# Altium project USBAutoMouse.PrjPcb
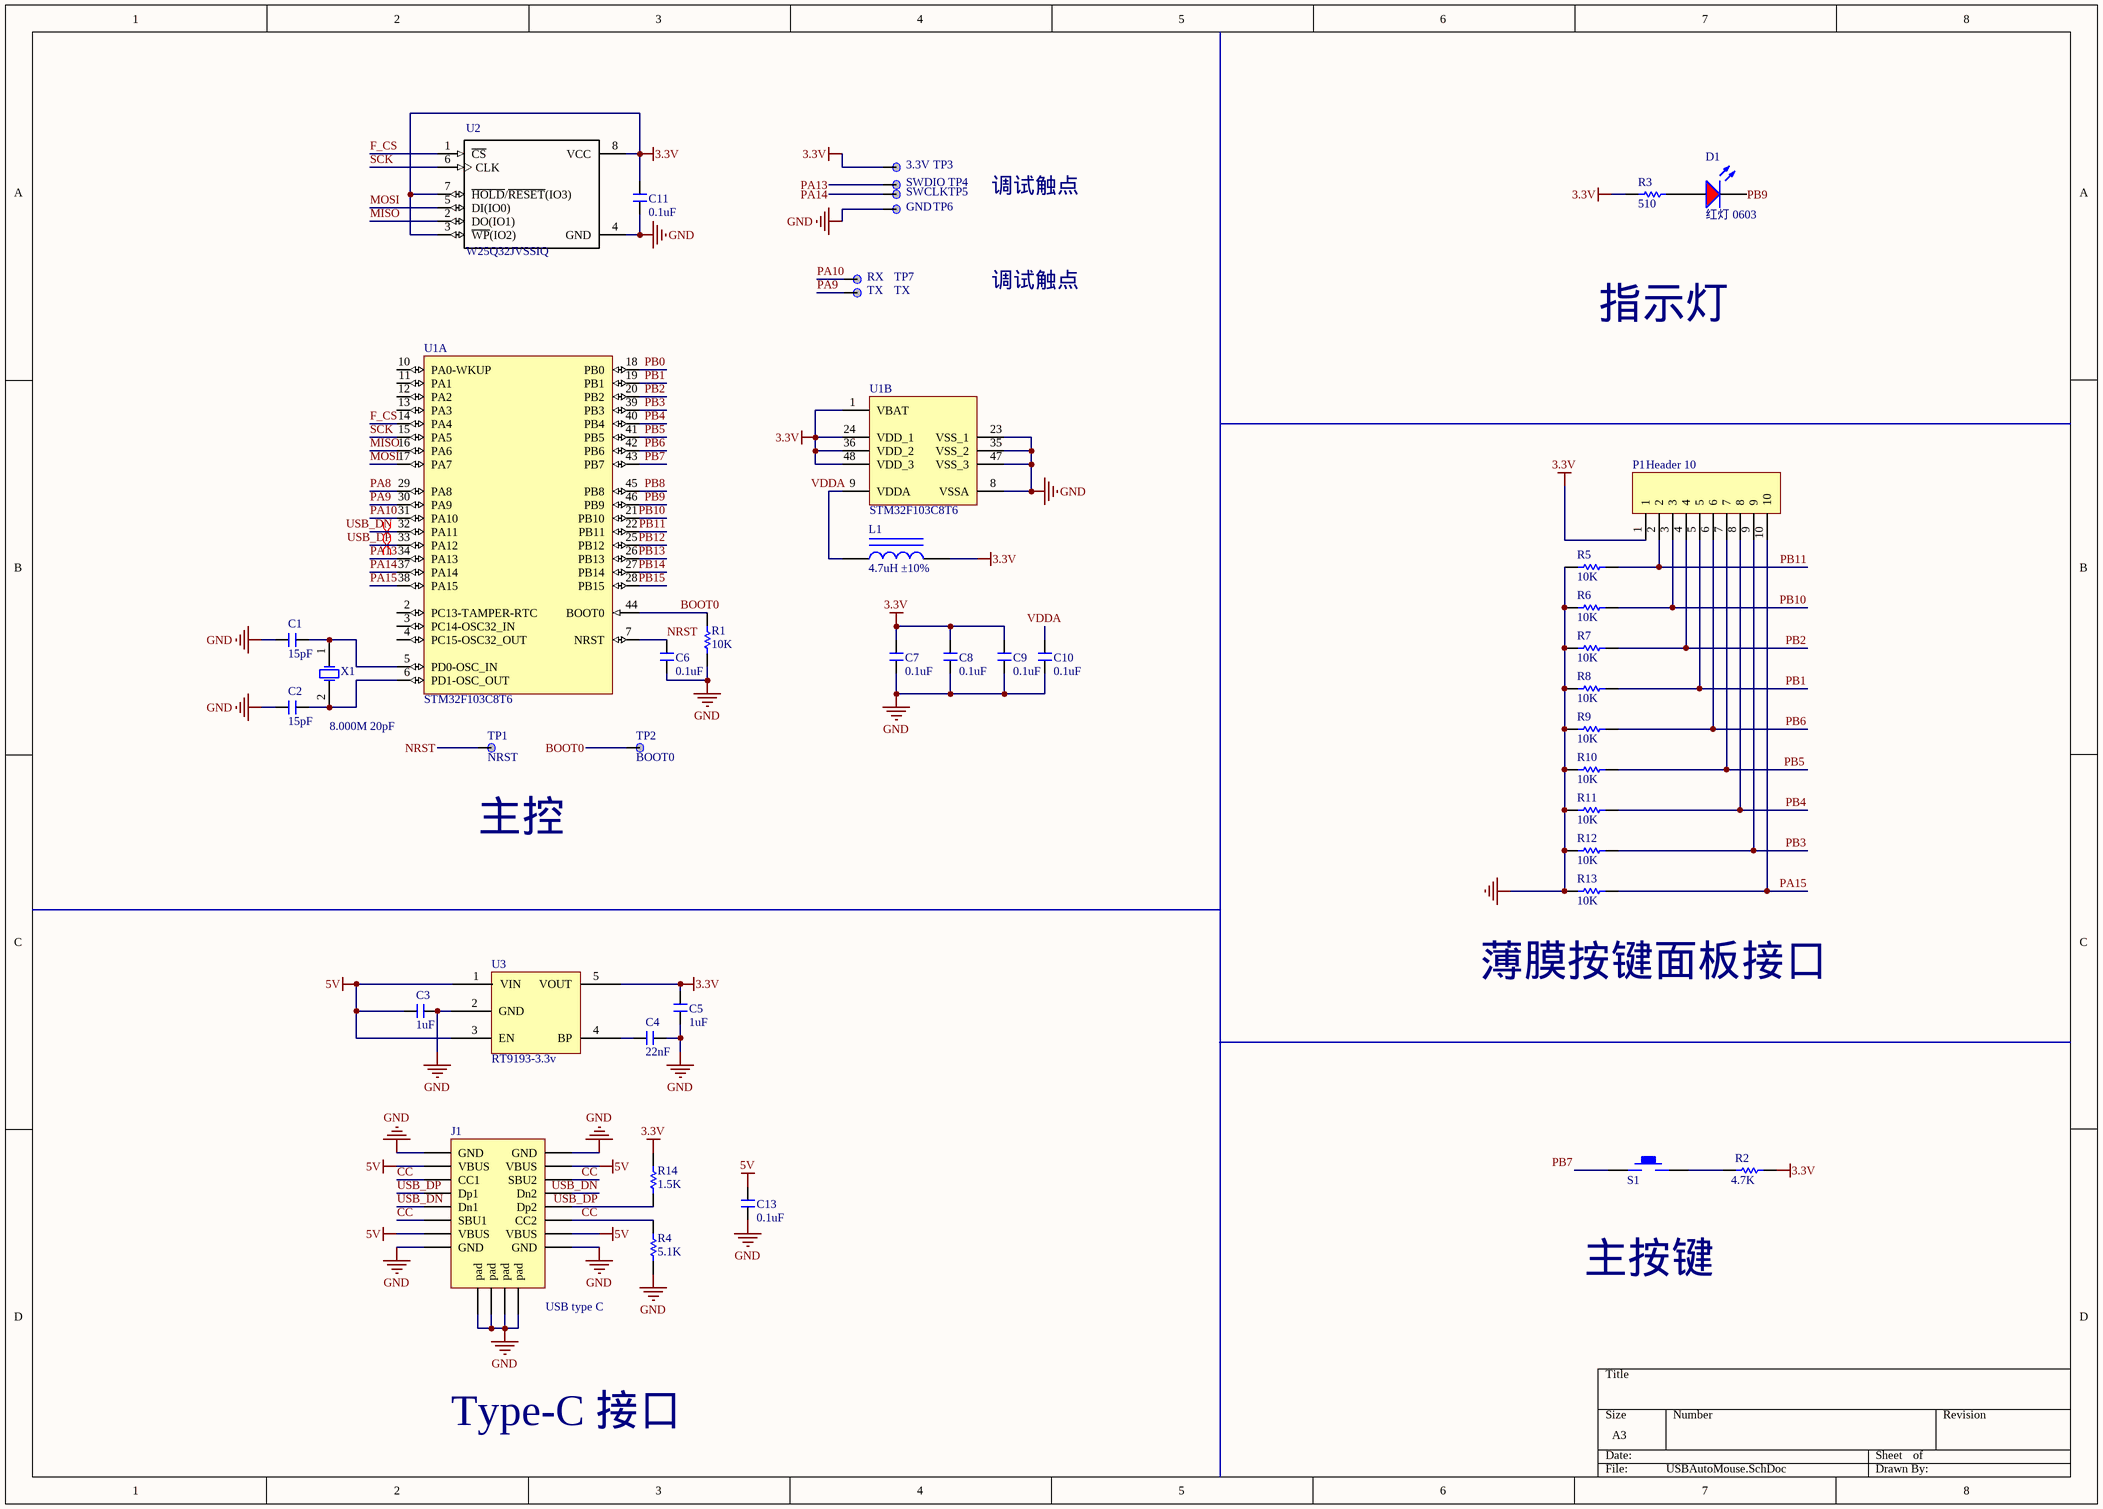
[diagram p0: USBAutoMouse.SchDoc]
1 sheet, 43 parts. Net scope: global (net labels, ports and power ports of the same name join across sheets).
Board file: USBAutoMouse.PcbDoc

## Sheet USBAutoMouse.SchDoc
size A3

### Parts
C1  15pF  [C 0603]
C2  15pF  [C 0603]
C3  1uF  [C 0603]
C4  22nF  [C 0603]
C5  1uF  [C 0603]
C6  0.1uF  [C 0603]
C7  0.1uF  [C 0603]
C8  0.1uF  [C 0603]
C9  0.1uF  [C 0603]
C10  0.1uF  [C 0603]
C11  0.1uF  [C 0603]
C13  0.1uF  [C 0603]
D1  红灯 0603  [0603_LED_S1]
J1  USB type C  [TYPE-C-USB-17]
L1  4.7uH ±10%  [0603_L]
P1  Header 10  [HDR1X10]
R1  10K  [0603R]
R2  4.7K  [0603R]
R3  510  [0603R]
R4  5.1K  [0603R]
R5  10K  [0603R]
R6  10K  [0603R]
R7  10K  [0603R]
R8  10K  [0603R]
R9  10K  [0603R]
R10  10K  [0603R]
R11  10K  [0603R]
R12  10K  [0603R]
R13  10K  [0603R]
R14  1.5K  [0603R]
S1  KEY  [KEY-12X12X7.5]  (value not drawn)
TP1  NRST  [TP]
TP2  BOOT0  [TP]
TP3  3.3V  [TP]
TP4  SWDIO  [TP]
TP5  SWCLK  [TP]
TP6  GND  [TP]
TP7  RX  [TP]
TX  TX  [TP]
U1  STM32F103C8T6  [STM-LQFP48_L]  (parts A,B of 2)
U2  W25Q32JVSSIQ  [*SOIC127P790X216-8N]
U3  RT9193-3.3v  [SOT-23-5L]
X1  8.000M 20pF  [OSC_2SM_3R2x2R5]

### Nets
3.3V: C5.2 C7.1 C8.1 C9.1 C11.1 L1.2 P1.1 R2.1 R3.2 R14.1 TP3.1 U1.1(VBAT) U1.24(VDD_1) U1.36(VDD_2) U1.48(VDD_3) U2.3(~{WP}(IO2)) U2.7(~{HOLD}/~{RESET}(IO3)) U2.8(VCC) U3.5(VOUT)
5V: C3.1 C13.2 J1.A4(VBUS) J1.A9(VBUS) J1.B4(VBUS) J1.B9(VBUS) U3.1(VIN) U3.3(EN)
GND: C1.1 C2.1 C3.2 C4.2 C5.1 C6.2 C7.2 C8.2 C9.2 C10.2 C11.2 C13.1 J1.0(pad) J1.A1(GND) J1.A12(GND) J1.B1(GND) J1.B12(GND) R1.1 R4.2 R5.1 R6.1 R7.1 R8.1 R9.1 R10.1 R11.1 R12.1 R13.1 TP6.1 U1.8(VSSA) U1.23(VSS_1) U1.35(VSS_2) U1.47(VSS_3) U2.4(GND) U3.2(GND)
BOOT0: R1.2 TP2.1 U1.44(BOOT0)
CC: J1.A5(CC1) J1.A8(SBU1) J1.B5(CC2) J1.B8(SBU2) R4.1
F_CS: U1.14(PA4) U2.1(~{CS})
MISO: U1.16(PA6) U2.2(DO(IO1))
MOSI: U1.17(PA7) U2.5(DI(IO0))
NRST: C6.1 TP1.1 U1.7(NRST)
PA8: U1.29(PA8)
PA9: TX.1 U1.30(PA9)
PA10: TP7.1 U1.31(PA10)
PA13: TP4.1 U1.34(PA13)
PA14: TP5.1 U1.37(PA14)
PA15: P1.10 R13.2 U1.38(PA15)
PB0: U1.18(PB0)
PB1: P1.5 R8.2 U1.19(PB1)
PB2: P1.4 R7.2 U1.20(PB2)
PB3: P1.9 R12.2 U1.39(PB3)
PB4: P1.8 R11.2 U1.40(PB4)
PB5: P1.7 R10.2 U1.41(PB5)
PB6: P1.6 R9.2 U1.42(PB6)
PB7: S1.1 U1.43(PB7)
PB8: U1.45(PB8)
PB9: D1.K U1.46(PB9)
PB10: P1.3 R6.2 U1.21(PB10)
PB11: P1.2 R5.2 U1.22(PB11)
PB12: U1.25(PB12)
PB13: U1.26(PB13)
PB14: U1.27(PB14)
PB15: U1.28(PB15)
SCK: U1.15(PA5) U2.6(CLK)
USB_DN: J1.A7(Dn1) J1.B7(Dn2) U1.32(PA11)
USB_DP: J1.A6(Dp1) J1.B6(Dp2) R14.2 U1.33(PA12)
VDDA: C10.1 L1.1 U1.9(VDDA)
NetC1_2: C1.2 U1.5(PD0-OSC_IN) X1.1(OSC1)
NetC2_2: C2.2 U1.6(PD1-OSC_OUT) X1.2(OSC2)
NetC4_1: C4.1 U3.4(BP)
NetD1_A: D1.A R3.1
NetR2_2: R2.2 S1.2

Not connected (* = marked no-connect by the designer): U1 2(PC13-TAMPER-RTC) 3(PC14-OSC32_IN) 4(PC15-OSC32_OUT) 10(PA0-WKUP) 11(PA1) 12(PA2) 13(PA3)

### Layout directives
differential pair: USB_DN, USB_DP

### Notes on the sheet
- 调试触点
- 指示灯
- (near TP1) 主控
- (near R13) 薄膜按键面板接口
- 主按键
- Type-C 接口

### Library data of the parts
C1-C11 C13 = C: 无极性贴片电容; 版权归属: 源创客; BOM名称: 无极性贴片电容; 学习资源: www.ooocke.com
D1 = 0603 红灯: 发光二极管; ComponentLink1Description: 供应商链接; ComponentLink1URL: http://www.szlcsc.com/product/details_2659.html; Package: 0603; Supplier: LC; SuppliersPartNumber: C2286
J1 = USB_C
L1 = 0603 4.7uH 10%: 贴片电感; ComponentLink1Description: 供应商链接; ComponentLink1URL: http://www.szlcsc.com/product/details_1386.html; Package: 0603; Supplier: LC; SuppliersPartNumber: C1034
P1 = Header 10: Header, 10-Pin; LatestRevisionDate: 17-Jul-2002; LatestRevisionNote: Re-released for DXP Platform.; Publisher: Altium Limited
R1-R14 = Res1: Resistor; Value: 1K; Ordered by: Subcon; Published: 8-Jun-2000; Revision: July-2002: Re-released for DXP Platform.; Publisher: Altium Limited
S1 = KEY: 普通轻触按钮
TP1-TP7 TX = TP
U1 = STM32F103C8T6: ARM Cortex-M3 32-bit MCU, 64 KB Flash, 20 KB Internal RAM, 37 I/Os, 48-pin LQFP, -40 to 85 degC, Tray; A/D Converter: 2x12-bit (10 Channel); FLASH Size (Prog) (kB): 64; I/Os (High Current): 37; Internal RAM Size (kB): 20; Operating Frequency(F) (Processor speed) (MHz): 72; Supply Voltage(Vcc) min (V): 2; DatasheetVersion: Rev. 16; PackageVersion: Rev. 6, 06/2013; PackageReference: LQFP48; PackageDescription: 48-Pin Low Profile Quad Flat Package, 7 x 7 mm Body, 0.5 mm Pitch; Supplier 1: Digi-Key; Supplier Part Number 1: 497-6063-ND; Supplier 2: Farnell; Supplier Part Number 2: 1447637; Supplier 3: Newark; Supplier Part Number 3: 59M2182; Supplier 4: Newark; Supplier Part Number 4: 57P1222; Supplier 5: Mouser; Supplier Part Number 5: 511-STM32F103C8T6; Core: ARM Cortex-M3; Packing: Tray; Mounting Technology: Surface Mount; PartNumber: STM32F103C8T6; ComponentLink1Description: Manufacturer URL; ComponentLink1URL: http://www.st.com/web/en/home.html; ComponentLink2Description: Datasheet; ComponentLink2URL: http://www.st.com/st-web-ui/static/active/en/resource/technical/document/datasheet/CD00161566.pdf; ComponentLink3Description: Package Specification; ComponentLink3URL: http://www.st.com/st-web-ui/static/active/en/resource/technical/document/datasheet/DM00058181.pdf
U2 = W25Q32JVSSIQ: NOR闂瓨涓茶SPI 3V 32Mbit 32M x 1浣?寮曡剼SOIC; MF: Winbond; Package: SOIC-8 Winbond; Price: None; MP: W25Q32JVSSIQ; SnapEDA_Link: https://www.snapeda.com/parts/W25Q32JVSSIQ/Winbond%20Electronics/view-part/?ref=snap; Availability: Unavailable; Value: *
U3 = RT9193
X1 = XTAL: Crystal Oscillator; Published: 8-Jun-2000; LatestRevisionDate: 17-Jul-2002; LatestRevisionNote: Re-released for DXP Platform.; PackageReference: R38; Publisher: Altium Limited